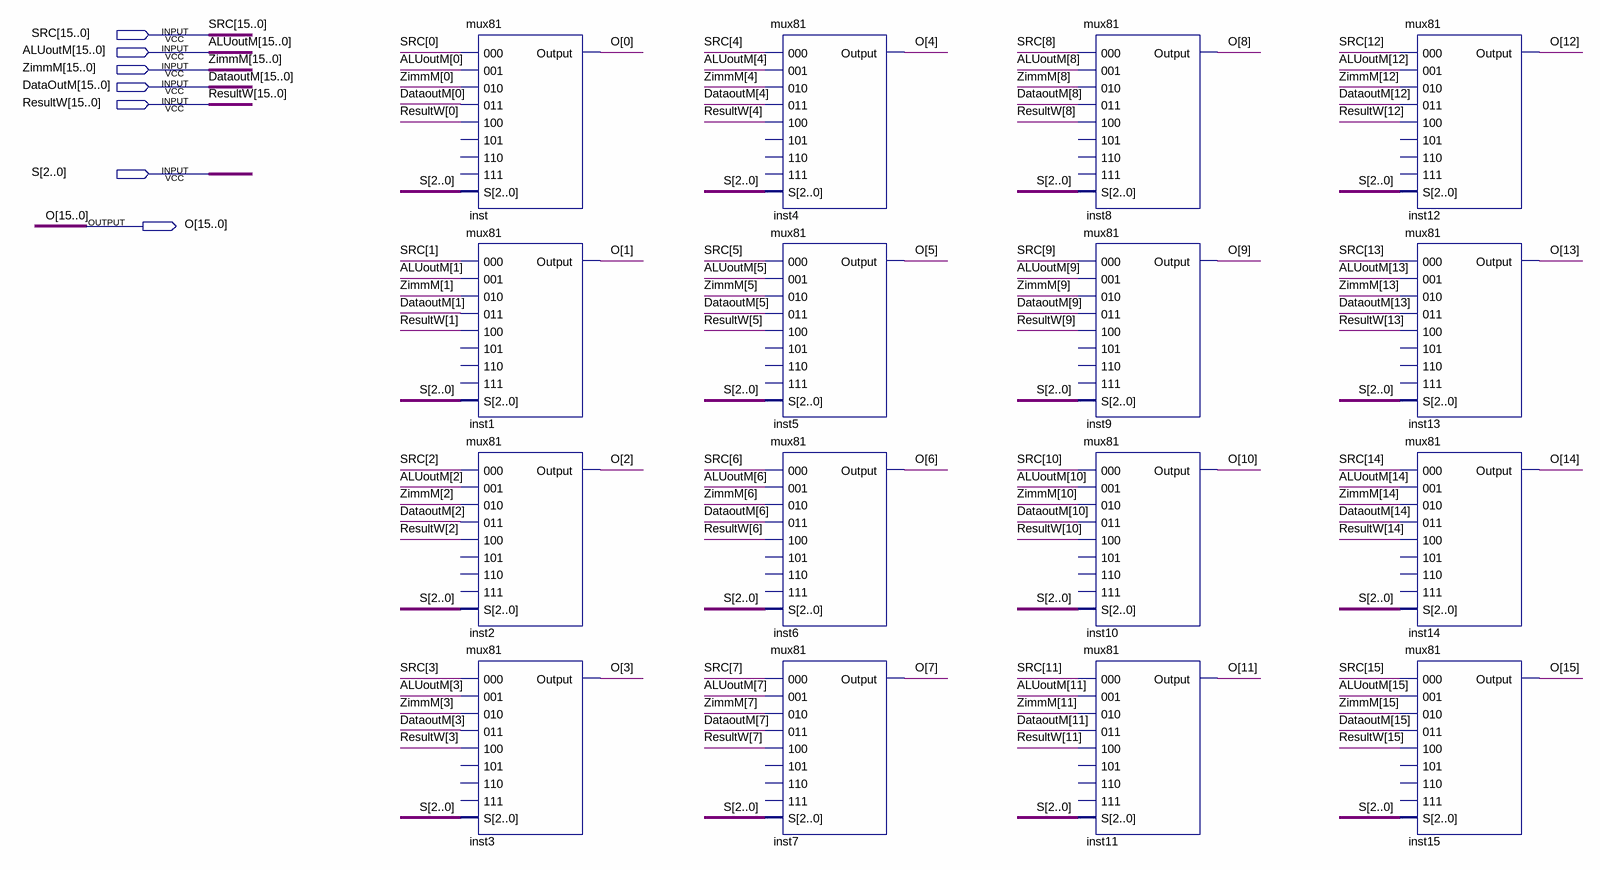
[diagram p0: schematic sheet]
// Quartus schematic mux51_forward.bdf as structural Verilog: 16 symbols, 7 pins
module mux51_forward (
  input  [15:0] SRC,
  input  [15:0] ALUoutM,
  input  [15:0] ZimmM,
  input  [15:0] DataOutM,
  input  [15:0] ResultW,
  input  [2:0] S,
  output [15:0] O
);

  mux81 inst (
    .\000 (SRC[0]), .\001 (ALUoutM[0]), .\010 (ZimmM[0]), .\011 (DataOutM[0]), .\100 (ResultW[0]), .S(S),
    .Output(O[0]));  // open: 101, 110, 111
  mux81 inst1 (
    .\000 (SRC[1]), .\001 (ALUoutM[1]), .\010 (ZimmM[1]), .\011 (DataOutM[1]), .\100 (ResultW[1]), .S(S),
    .Output(O[1]));  // open: 101, 110, 111
  mux81 inst2 (
    .\000 (SRC[2]), .\001 (ALUoutM[2]), .\010 (ZimmM[2]), .\011 (DataOutM[2]), .\100 (ResultW[2]), .S(S),
    .Output(O[2]));  // open: 101, 110, 111
  mux81 inst3 (
    .\000 (SRC[3]), .\001 (ALUoutM[3]), .\010 (ZimmM[3]), .\011 (DataOutM[3]), .\100 (ResultW[3]), .S(S),
    .Output(O[3]));  // open: 101, 110, 111
  mux81 inst4 (
    .\000 (SRC[4]), .\001 (ALUoutM[4]), .\010 (ZimmM[4]), .\011 (DataOutM[4]), .\100 (ResultW[4]), .S(S),
    .Output(O[4]));  // open: 101, 110, 111
  mux81 inst5 (
    .\000 (SRC[5]), .\001 (ALUoutM[5]), .\010 (ZimmM[5]), .\011 (DataOutM[5]), .\100 (ResultW[5]), .S(S),
    .Output(O[5]));  // open: 101, 110, 111
  mux81 inst6 (
    .\000 (SRC[6]), .\001 (ALUoutM[6]), .\010 (ZimmM[6]), .\011 (DataOutM[6]), .\100 (ResultW[6]), .S(S),
    .Output(O[6]));  // open: 101, 110, 111
  mux81 inst7 (
    .\000 (SRC[7]), .\001 (ALUoutM[7]), .\010 (ZimmM[7]), .\011 (DataOutM[7]), .\100 (ResultW[7]), .S(S),
    .Output(O[7]));  // open: 101, 110, 111
  mux81 inst8 (
    .\000 (SRC[8]), .\001 (ALUoutM[8]), .\010 (ZimmM[8]), .\011 (DataOutM[8]), .\100 (ResultW[8]), .S(S),
    .Output(O[8]));  // open: 101, 110, 111
  mux81 inst9 (
    .\000 (SRC[9]), .\001 (ALUoutM[9]), .\010 (ZimmM[9]), .\011 (DataOutM[9]), .\100 (ResultW[9]), .S(S),
    .Output(O[9]));  // open: 101, 110, 111
  mux81 inst10 (
    .\000 (SRC[10]), .\001 (ALUoutM[10]), .\010 (ZimmM[10]), .\011 (DataOutM[10]), .\100 (ResultW[10]),
    .S(S), .Output(O[10]));  // open: 101, 110, 111
  mux81 inst11 (
    .\000 (SRC[11]), .\001 (ALUoutM[11]), .\010 (ZimmM[11]), .\011 (DataOutM[11]), .\100 (ResultW[11]),
    .S(S), .Output(O[11]));  // open: 101, 110, 111
  mux81 inst12 (
    .\000 (SRC[12]), .\001 (ALUoutM[12]), .\010 (ZimmM[12]), .\011 (DataOutM[12]), .\100 (ResultW[12]),
    .S(S), .Output(O[12]));  // open: 101, 110, 111
  mux81 inst13 (
    .\000 (SRC[13]), .\001 (ALUoutM[13]), .\010 (ZimmM[13]), .\011 (DataOutM[13]), .\100 (ResultW[13]),
    .S(S), .Output(O[13]));  // open: 101, 110, 111
  mux81 inst14 (
    .\000 (SRC[14]), .\001 (ALUoutM[14]), .\010 (ZimmM[14]), .\011 (DataOutM[14]), .\100 (ResultW[14]),
    .S(S), .Output(O[14]));  // open: 101, 110, 111
  mux81 inst15 (
    .\000 (SRC[15]), .\001 (ALUoutM[15]), .\010 (ZimmM[15]), .\011 (DataOutM[15]), .\100 (ResultW[15]),
    .S(S), .Output(O[15]));  // open: 101, 110, 111
endmodule
